# EAGLE design A4a Pro Mini (EAGLE 9.6.2)
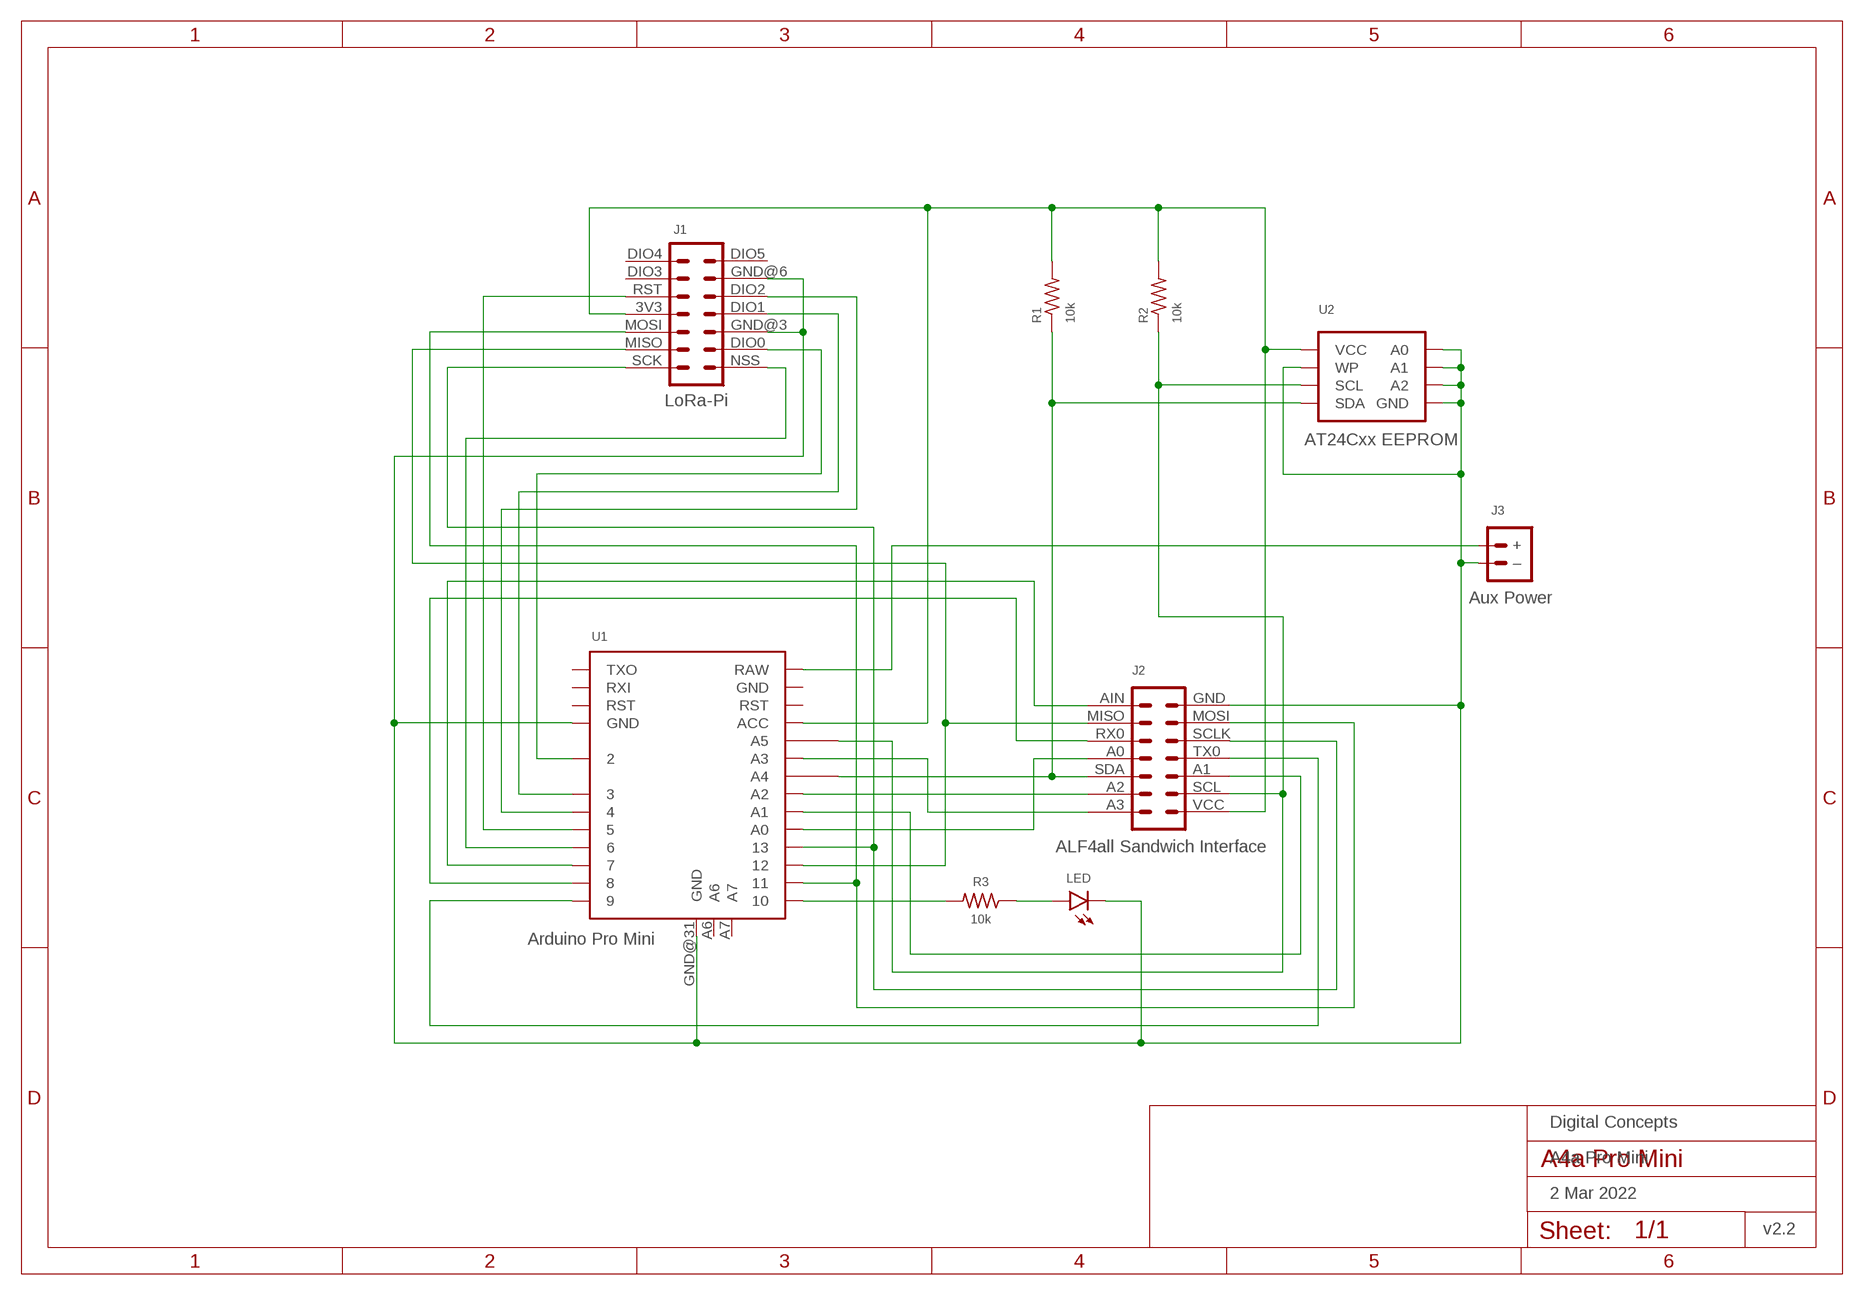
[diagram p0: schematic, sheet 1]
FRAME1 (A4L-LOC): DATE: 2 Mar 2022; OWNER: Digital Concepts; TITLE: A4a Pro Mini; VERSION: v2.2

## Parts
J1  LoRa-Pi  RFM95W-PI-HEADER  [RFM95W-PI]
J2  ALF4all Sandwich Interface  HEADER-2X7-ALF4ALL-PROCESSOR-B  [CONN_2X7-ALF4ALL-PROCESSOR-B]
J3  Aux Power  JST-PH2.0-2-MALE-HORIZONTALJST-PTH-2  [JST-PH2.0-2-HORIZONTAL]
LED  LEDCHIP-LED0805  [CHIP-LED0805]
R1  10k  RESISTORR0805  [R0805]
R2  10k  RESISTORR0805  [R0805]
R3  10k  RESISTORR0805  [R0805]
U1  Arduino Pro Mini  ARDUINO-PRO-MINI-35  [ARDUINO-PRO-MINI-35]
U2  AT24Cxx EEPROM  AT24CXX-EEPROM  [SOP-8]

## Nets
GND: J1.GND@3 J1.GND@6 J2.GND J3.-(–) LED.C U1.GND@22(GND) U1.GND@31(GND) U2.P$1(A0) U2.P$2(A1) U2.P$3(A2) U2.P$4(GND) U2.P$7(WP)
N$1: J2.A0 U1.A0
N$2: J2.A1 U1.A1
N$3: J2.A2 U1.A2
N$4: J2.A3 U1.A3
N$5: J3.+ U1.RAW
N$6: J1.SCK J2.SCLK U1.13
N$7: J2.RX0 U1.8
N$9: J2.AIN U1.7
N$10: J2.SDA R1.1 U1.A4 U2.P$5(SDA)
N$11: J2.SCL R2.1 U1.A5 U2.P$6(SCL)
N$12: J1.MISO J2.MISO U1.12
N$13: J1.MOSI J2.MOSI U1.11
N$14: J2.TX0 U1.9
N$15: J1.NSS U1.6
N$16: J1.RST U1.5
N$17: J1.DIO2 U1.4
N$18: J1.DIO1 U1.3
N$19: J1.DIO0 U1.2
N$20: R3.2 U1.10
N$21: LED.A R3.1
VCC: J1.3V3 J2.VCC R1.2 R2.2 U1.ACC U2.P$8(VCC)
Unconnected: J1.DIO3 J1.DIO4 J1.DIO5 U1.A6 U1.A7 U1.GND@11(GND) U1.RST@10(RST) U1.RST@21(RST) U1.RXI@20(RXI) U1.TXO@19(TXO)

## Library data of the parts
J1 = digitalconcepts:RFM95W-PI-HEADER: RFM95W LoRa Wireless Transceiver Raspberry Pi Daughter Board
J2 = digitalconcepts:HEADER-2X7-ALF4ALL-PROCESSOR-B: ALF4all 'Sandwich' Processor (Bottom) 2x7 Pin Header Header soldered to underside of PCB
J3 = digitalconcepts:JST-PH2.0-2-MALE-HORIZONTAL: Multi connection point. Often used as Generic Header-pin footprint for 0.1 inch spaced/style header connections On any of the 0.1 inch spaced packages, you can populate with these: Break Away Headers - Straight <https://www.sparkfun.com/products/116> (PRT-00116) Break Away Male Headers - Right Angle <https://www.sparkfun.com/products/553> (PRT-00553) Female Headers <https://www.sparkfun.com/products/115> (PRT-00115) Break Away Headers - Machine Pin <https://www.sparkfun.com/products/117> (PRT-00117) Break Away Female Headers - Swiss Machine Pin <https://www.sparkfun.com/products/743> (PRT-00743) For SCREWTERMINALS and SPRING TERMINALS visit here: Screw Terimnals on SparkFun.com <https://www.sparkfun.com/search/results?term=Screw+Terminals> (5mm/3.5mm/2.54mm spacing) This device is also useful as a general connection point to wire up your design to another part of your project. Our various solder wires solder well into these plated through hole pads. Hook-Up Wire - Assortment (Stranded, 22 AWG) <https://www.sparkfun.com/products/11375> (PRT-11375) Hook-Up Wire - Assortment (Solid Core, 22 AWG) <https://www.sparkfun.com/products/11367> (PRT-11367) View the entire wire category on our website here <https://www.sparkfun.com/categories/141> Special notes: Molex polarized connector foot print use with: PRT-08233 with associated crimp pins and housings. 2.54_SCREWTERM for use with PRT-10571. 3.5mm Screw Terminal footprints for PRT-08084 5mm Screw Terminal footprints for use with PRT-08432; PROD_ID: CONN-09863; SKU: PRT-09914
LED = digitalconcepts:LED: LED OSRAM: - CHIPLED LG R971, LG N971, LY N971, LG Q971, LY Q971, LO R971, LY R971 LH N974, LH R974 LS Q976, LO Q976, LY Q976 LO Q996 - Hyper CHIPLED LW Q18S LB Q993, LB Q99A, LB R99A - SideLED LS A670, LO A670, LY A670, LG A670, LP A670 LB A673, LV A673, LT A673, LW A673 LH A674 LY A675 LS A676, LA A676, LO A676, LY A676, LW A676 LS A679, LY A679, LG A679 - Hyper Micro SIDELED® LS Y876, LA Y876, LO Y876, LY Y876 LT Y87S - SmartLED LW L88C, LW L88S LB L89C, LB L89S, LG L890 LS L89K, LO L89K, LY L89K LS L896, LA L896, LO L896, LY L896 - TOPLED LS T670, LO T670, LY T670, LG T670, LP T670 LSG T670, LSP T670, LSY T670, LOP T670, LYG T670 LG T671, LOG T671, LSG T671 LB T673, LV T673, LT T673, LW T673 LH T674 LS T676, LA T676, LO T676, LY T676, LB T676, LH T676, LSB T676, LW T676 LB T67C, LV T67C, LT T67C, LS T67K, LO T67K, LY T67K, LW E67C LS E67B, LA E67B, LO E67B, LY E67B, LB E67C, LV E67C, LT E67C LW T67C LS T679, LY T679, LG T679 LS T770, LO T770, LY T770, LG T770, LP T770 LB T773, LV T773, LT T773, LW T773 LH T774 LS E675, LA E675, LY E675, LS T675 LS T776, LA T776, LO T776, LY T776, LB T776 LHGB T686 LT T68C, LB T68C - Hyper Mini TOPLED® LB M676 - Mini TOPLED Santana® LG M470 LS M47K, LO M47K, LY M47K Source: http://www.osram.convergy.de LUXEON: - LUMILED® LXK2-PW12-R00, LXK2-PW12-S00, LXK2-PW14-U00, LXK2-PW14-V00 LXK2-PM12-R00, LXK2-PM12-S00, LXK2-PM14-U00 LXK2-PE12-Q00, LXK2-PE12-R00, LXK2-PE12-S00, LXK2-PE14-T00, LXK2-PE14-U00 LXK2-PB12-K00, LXK2-PB12-L00, LXK2-PB12-M00, LXK2-PB14-N00, LXK2-PB14-P00, LXK2-PB14-Q00 LXK2-PR12-L00, LXK2-PR12-M00, LXK2-PR14-Q00, LXK2-PR14-R00 LXK2-PD12-Q00, LXK2-PD12-R00, LXK2-PD12-S00 LXK2-PH12-R00, LXK2-PH12-S00 LXK2-PL12-P00, LXK2-PL12-Q00, LXK2-PL12-R00 Source: www.luxeon.com KINGBRIGHT: KA-3528ASYC Source: www.kingbright.com
R1-R3 = digitalconcepts:RESISTOR: Resistor; SPICEPREFIX: R
U1 = digitalconcepts:ARDUINO-PRO-MINI-35: Arduino Pro Mini 35-pin Clone
U2 = digitalconcepts:AT24CXX-EEPROM: AT24Cxx EEPROM SOP-8

## Board
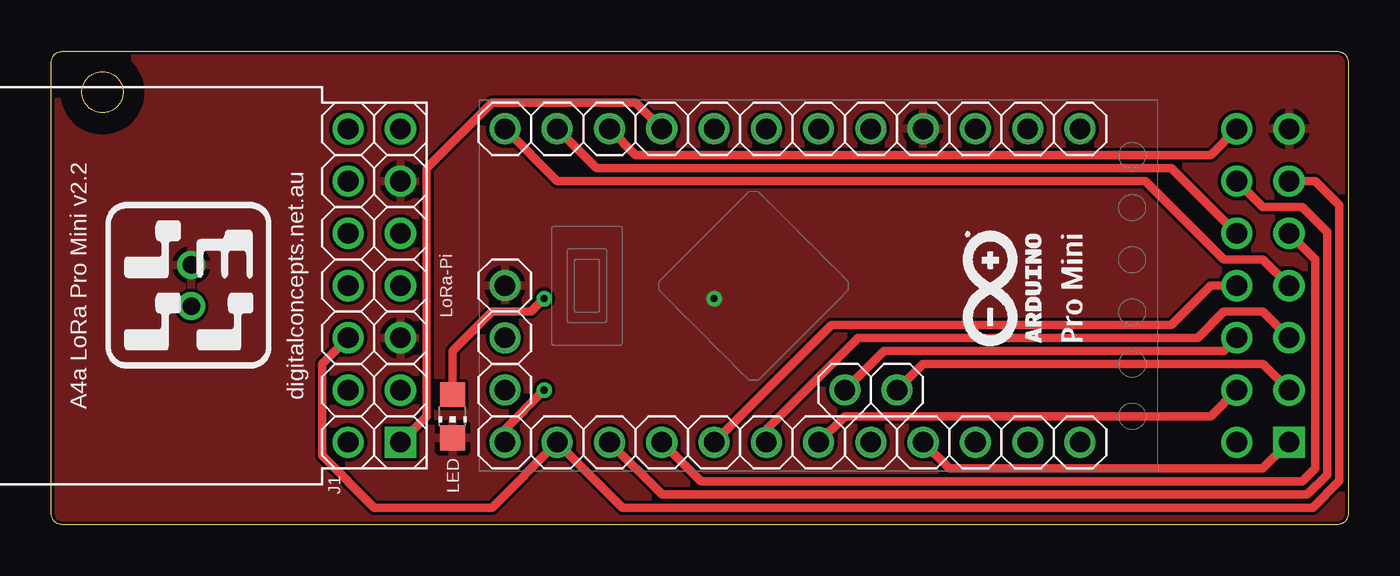
[diagram p1: board, top side]
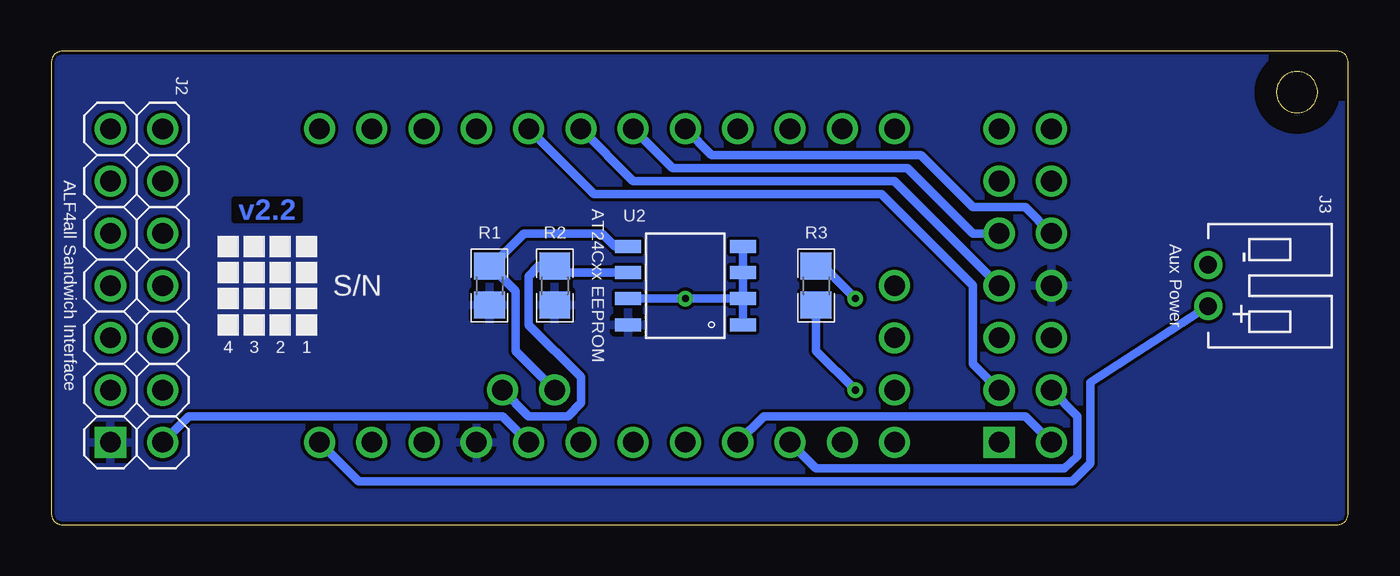
[diagram p2: board, bottom side, seen from below]

Size 63 x 23 mm. Coordinates in mm from the lower left corner, seen from the top.
Outline: 62.54,23 62.57,23 62.6,22.99 62.63,22.98 62.66,22.97 62.69,22.96 62.72,22.95 62.75,22.93 62.78,22.91 62.81,22.9 62.83,22.88 62.85,22.85 62.88,22.83 62.9,22.81 62.91,22.78 62.93,22.75 62.95,22.72 62.96,22.69 62.97,22.66 62.98,22.63 62.99,22.6 63,22.57 63,22.53 63,0.47 63,0.43 62.99,0.4 62.98,0.37 62.97,0.34 62.96,0.31 62.95,0.28 62.93,0.25 62.91,0.22 62.9,0.19 62.88,0.17 62.85,0.15 62.83,0.12 62.81,0.1 62.78,0.09 62.75,0.07 62.72,0.05 62.69,0.04 62.66,0.03 62.63,0.02 62.6,0.01 62.57,0 62.54,0 0.47,0 0.43,0 0.37,0.02 0.34,0.03 0.31,0.04 0.28,0.05 0.25,0.07 0.22,0.09 0.19,0.1 0.17,0.12 0.15,0.15 0.12,0.17 0.1,0.19 0.09,0.22 0.07,0.25 0.05,0.28 0.03,0.34 0.02,0.37 0.01,0.4 0,0.43 0,0.47 0,22.53 0,22.57 0.01,22.6 0.02,22.63 0.03,22.66 0.05,22.72 0.07,22.75 0.09,22.78 0.1,22.81 0.12,22.83 0.15,22.85 0.17,22.88 0.19,22.9 0.22,22.91 0.25,22.93 0.28,22.95 0.31,22.96 0.34,22.97 0.37,22.98 0.4,22.99 0.43,23 0.47,23 62.54,23
Outline: 2.55,22.02 2.62,22.01 2.68,22 2.75,21.98 2.81,21.96 2.87,21.94 2.93,21.91 2.99,21.88 3.04,21.85 3.09,21.81 3.14,21.77 3.19,21.73 3.23,21.68 3.27,21.63 3.31,21.58 3.35,21.52 3.38,21.47 3.4,21.41 3.43,21.35 3.45,21.28 3.46,21.22 3.47,21.15 3.48,21.09 3.48,20.95 3.47,20.88 3.46,20.82 3.45,20.75 3.43,20.69 3.4,20.63 3.38,20.57 3.35,20.51 3.31,20.46 3.27,20.41 3.23,20.36 3.14,20.27 3.09,20.22 3.04,20.19 2.99,20.15 2.93,20.12 2.87,20.1 2.81,20.07 2.75,20.05 2.68,20.04 2.62,20.03 2.55,20.02 2.41,20.02 2.34,20.03 2.28,20.04 2.21,20.05 2.15,20.07 2.09,20.1 2.03,20.12 1.97,20.15 1.92,20.19 1.87,20.22 1.82,20.27 1.73,20.36 1.69,20.41 1.65,20.46 1.62,20.51 1.58,20.57 1.56,20.63 1.53,20.69 1.51,20.75 1.5,20.82 1.49,20.88 1.48,20.95 1.48,21.09 1.49,21.15 1.5,21.22 1.51,21.28 1.53,21.35 1.56,21.41 1.58,21.47 1.62,21.52 1.65,21.58 1.69,21.63 1.73,21.68 1.77,21.73 1.82,21.77 1.87,21.81 1.92,21.85 1.97,21.88 2.03,21.91 2.09,21.94 2.15,21.96 2.21,21.98 2.28,22 2.34,22.01 2.41,22.02 2.55,22.02
Copper layers (1*16): Top 0.035mm / dielectric 1.5mm / Bottom 0.035mm
Design rules "default *": minimum track width 6mil, minimum drill 0.35mm, track to track 6mil, track to pad 6mil, pad to pad 6mil, via to via 6mil, smd to smd 6mil, copper to edge 6mil, drill to drill 6mil, minimum pad ring 10mil, minimum via ring 8mil, stop-mask expansion 4mil, vias tented up to drill 0mil, thermal gap 10mil

### Footprints (pad centres in the part's own frame; a part is rotated, then mirrored left to right if it is on the bottom)
RFM95W-PI = drill 1 pad 1.524: 3V3 7.62,2.54; DIO0 2.54,0; DIO1 7.62,0; DIO2 10.16,0; DIO3 12.7,2.54; DIO4 15.24,2.54; DIO5 15.24,0; GND@3 5.08,0; GND@6 12.7,0; MISO 2.54,2.54; MOSI 5.08,2.54; RST 10.16,2.54; SCK 0,2.54 | drill 1 pad 1.524 square: NSS 0,0
CONN_2X7-ALF4ALL-PROCESSOR-B = drill 1 pad 1.524: A0 7.62,2.54; A1 5.08,0; A2 2.54,2.54; A3 0,2.54; AIN 15.24,2.54; GND 15.24,0; MISO 12.7,2.54; MOSI 12.7,0; RX0 10.16,2.54; SCL 2.54,0; SCLK 10.16,0; SDA 5.08,2.54; TX0 7.62,0 | drill 1 pad 1.524 square: VCC 0,0
JST-PH2.0-2-HORIZONTAL = drill 0.85: + 1,0; - -1,0
CHIP-LED0805 = smd 1.2 x 1.2: A 0,-1.05; C 0,1.05
R0805 = smd 1.3 x 1.5: 1 -0.95,0; 2 0.95,0
ARDUINO-PRO-MINI-35 = drill 1: 2 -15.24,17.78; 3 -15.24,15.24; 4 -15.24,12.7; 5 -15.24,10.16; 6 -15.24,7.62; 7 -15.24,5.08; 8 -15.24,2.54; 9 -15.24,0; 10 0,0; 11 0,2.54; 12 0,5.08; 13 0,7.62; A0 0,10.16; A1 0,12.7; A2 0,15.24; A3 0,17.78; A4 -2.54,16.51; A5 -2.54,19.05; A6 -5.08,0; A7 -2.54,0; ACC 0,20.32; GND@11 0,25.4; GND@22 -15.24,20.32; GND@31 -7.62,0; RAW 0,27.94; RST@10 0,22.86; RST@21 -15.24,22.86; RXI@20 -15.24,25.4; TXO@19 -15.24,27.94
SOP-8 = smd 0.635 x 1.27: P$1 -1.905,-2.794; P$2 -0.635,-2.794; P$3 0.635,-2.794; P$4 1.905,-2.794; P$5 1.905,2.794; P$6 0.635,2.794; P$7 -0.635,2.794; P$8 -1.905,2.794

### Placement (x,y rotation side)
J1  16.96,4 90 top
J2  60.14,4 90 top
J3  6.8,11.62 270 bottom
LED  19.5,5.27 180 top
R1  41.72,11.62 270 bottom
R2  38.55,11.62 270 bottom
R3  25.85,11.62 270 bottom
U1  22.04,4 270 top
U2  32.2,11.62 90 bottom

### Tracks (layer width: path | path; a pad name or v marks a point on that pad's centre or on a via)
$X1
  cutout Top: 2.48,23.05 arc180 2.48,18.98 arc180
$X10
  cutout Bottom: 2.48,23.05 arc180 2.48,18.98 arc180
GND  (via drill 0.35)
  Bottom 0.406: U2.P$2 U2.P$3 U2.P$4 | U2.P$2 U2.P$1 | U2.P$2 v32.2,10.98 U2.P$7
  pour Top: -2.09,25.59 65.22,25.59 65.22,-2.35 -2.09,-2.35
N$1
  Top 0.406: J2.A0 56.33,11.62 54.42,9.71 37.91,9.71 U1.A0
N$2
  Top 0.406: J2.A1 58.87,10.35 56.96,10.35 55.69,9.08 39.18,9.08 34.74,4.63 U1.A1
N$3
  Top 0.406: J2.A2 56.33,5.27 38.55,5.27 U1.A2
N$4
  Bottom 0.406: J2.A3 56.33,5.27 41.09,5.27 U1.A3
N$5
  Bottom 0.406: J3.+ 12.51,6.9 12.51,2.98 13.4,2.09 48.07,2.09 U1.RAW
N$6
  Top 0.406: J2.SCLK 61.41,12.89 61.41,2.73 60.77,2.09 31.56,2.09 U1.13
  Bottom 0.406: J1.SCK 15.69,5.27 28.39,5.27 U1.13
N$7
  Top 0.406: J2.RX0 54.42,17.33 26.48,17.33 U1.8
N$9
  Top 0.406: J2.AIN 56.33,17.97 28.39,17.97 U1.7
N$10
  Top 0.406: J2.SDA 56.96,8.44 40.45,8.44 U1.A4
  Bottom 0.406: U2.P$5 35.62,13.52 36.26,14.16 40.03,14.16 41.62,12.57 R1.1 41.67,12.57 40.45,11.35 40.45,8.44 U1.A4
N$11
  Top 0.406: J2.SCL 58.87,7.81 42.36,7.81 U1.A5
  Bottom 0.406: U1.A5 39.82,5.27 37.91,5.27 37.28,5.9 37.28,7.17 39.82,9.71 39.82,12.07 39.33,12.57 R2.1 38.23,12.25 U2.P$6
N$12
  Top 0.406: J2.MISO 58.87,15.43 60.77,15.43 61.99,14.21 61.99,2.42 61.02,1.46 29.66,1.46 U1.12
  Bottom 0.406: J1.MISO 13.15,5.27 13.15,3.31 13.78,2.73 25.85,2.73 U1.12
N$13
  Top 0.406: J2.MOSI 61.41,16.7 62.57,15.53 62.57,2.12 61.28,0.82 27.75,0.82 U1.11 21.4,0.82 15.69,0.82 13.15,3.36 13.15,7.81 J1.MOSI
N$14
  Top 0.406: J2.TX0 58.87,12.89 56.96,12.89 53.15,16.7 24.58,16.7 U1.9
N$15
  Top 0.406: J1.NSS 18.23,5.27 18.23,17.33 21.4,20.51 28.39,20.51 U1.6
N$16
  Bottom 0.406: J1.RST 15.69,15.43 18.23,15.43 20.77,17.97 30.93,17.97 U1.5
N$17
  Bottom 0.406: U1.4 32.83,17.33 21.4,17.33 18.23,14.16 J1.DIO2
N$18
  Bottom 0.406: U1.3 34.74,16.7 22.04,16.7 J1.DIO1
N$19
  Bottom 0.406: U1.2 36.64,16.06 22.67,16.06 18.23,11.62 18.23,7.81 J1.DIO0
N$20  (via drill 0.35)
  Top 0.406: v23.94,6.54 22.04,4.63 U1.10
  Bottom 0.406: v23.94,6.54 25.85,8.44 R3.2
N$21  (via drill 0.35)
  Top 0.406: v23.94,10.98 23.3,10.35 21.4,10.35 19.5,8.44 LED.A
  Bottom 0.406: R3.1 25.53,12.57 v23.94,10.98
VCC
  Top 0.406: J2.VCC 58.87,2.73 43.63,2.73 U1.ACC
  pour Bottom: -0.82,24.32 63.95,24.32 63.95,-1.08 -0.82,-1.08

### Text on the board
Bottom: v2.2
tPlace: A4a LoRa Pro Mini v2.2 | digitalconcepts.net.au
bPlace: S/N | 1 | 2 | 3 | 4